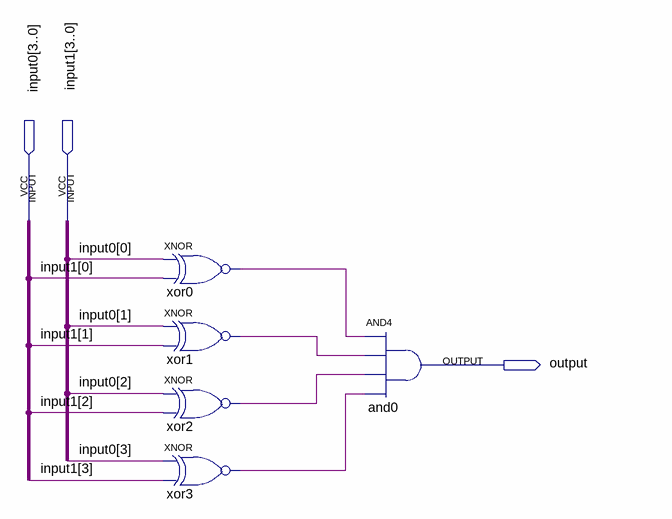
[diagram p0: schematic sheet]
// Quartus schematic EqCmpDemo.bdf as structural Verilog: 5 symbols, 3 pins
module EqCmpDemo (
  input  [3:0] input0,
  input  [3:0] input1,
  output \output 
);

  wire xor0_out, xor1_out, xor2_out, xor3_out;

  xnor xor0 (xor0_out, input0[0], input1[0]);
  xnor xor1 (xor1_out, input0[1], input1[1]);
  xnor xor2 (xor2_out, input0[2], input1[2]);
  xnor xor3 (xor3_out, input0[3], input1[3]);
  and and0 (\output , xor0_out, xor1_out, xor2_out, xor3_out);
endmodule
